# EAGLE schematic base (EAGLE 6.5.0)
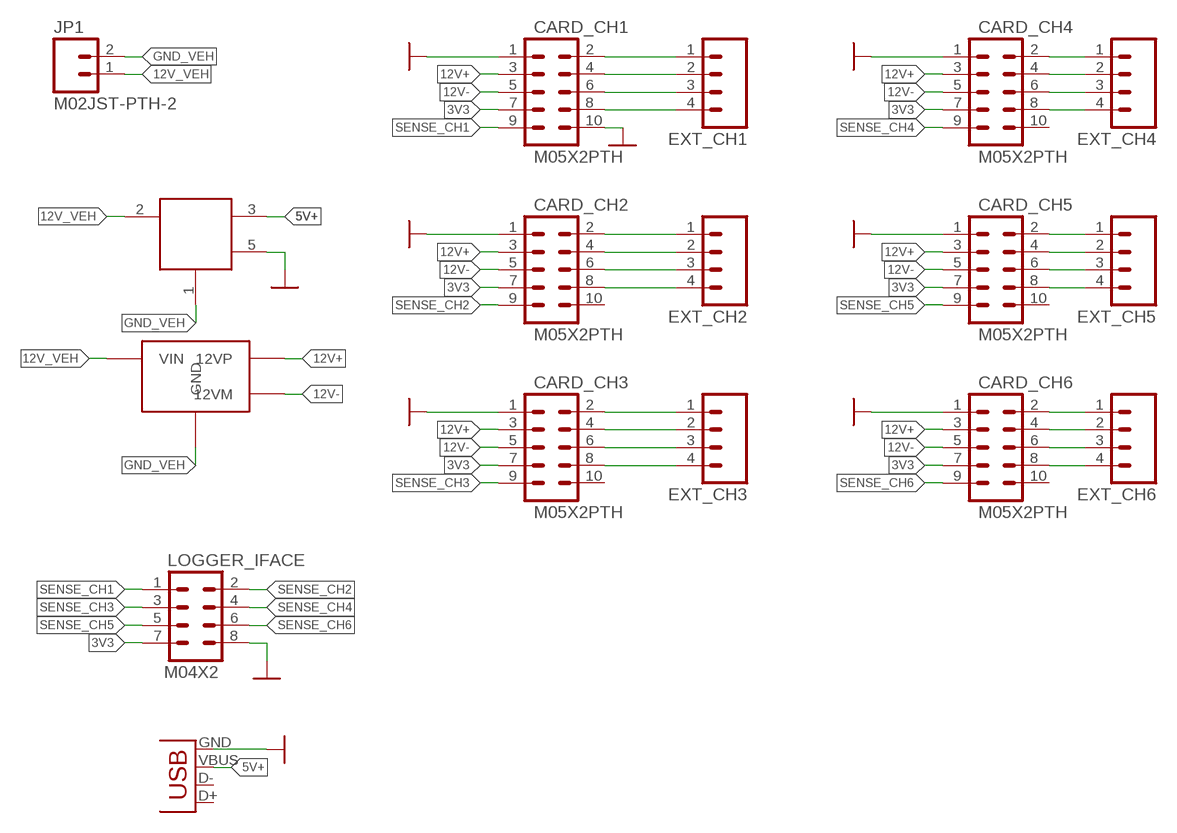
[diagram p0: schematic, sheet 1]

## Parts
CARD_CH1  M05X2PTH  [AVR_ICSP]
CARD_CH2  M05X2PTH  [AVR_ICSP]
CARD_CH3  M05X2PTH  [AVR_ICSP]
CARD_CH4  M05X2PTH  [AVR_ICSP]
CARD_CH5  M05X2PTH  [AVR_ICSP]
CARD_CH6  M05X2PTH  [AVR_ICSP]
EXT_CH1  M04PTH  [1X04]
EXT_CH2  M04PTH  [1X04]
EXT_CH3  M04PTH  [1X04]
EXT_CH4  M04PTH  [1X04]
EXT_CH5  M04PTH  [1X04]
EXT_CH6  M04PTH  [1X04]
JP1  M02JST-PTH-2  [JST-2-PTH]
JP2  USB-A-S  [USB-A-S]
LOGGER_IFACE  M04X2  [2X4]
U$1  NMXS1205UC_PTH  [NMXS1205UC_PTH]
U$2  TMR3122_12_CONV_PTH  [TMR3122_12_CONV_PTH]

## Nets
3V3: CARD_CH1.7 CARD_CH2.7 CARD_CH3.7 CARD_CH4.7 CARD_CH5.7 CARD_CH6.7 LOGGER_IFACE.7
5V+: JP2.VBUS U$1.3(5VOUT)
12V+: CARD_CH1.3 CARD_CH2.3 CARD_CH3.3 CARD_CH4.3 CARD_CH5.3 CARD_CH6.3 U$2.5(12VP)
12V-: CARD_CH1.5 CARD_CH2.5 CARD_CH3.5 CARD_CH4.5 CARD_CH5.5 CARD_CH6.5 U$2.6(12VM)
12V_VEH: JP1.1 U$1.2(VIN) U$2.2(VIN)
GND: CARD_CH1.1 CARD_CH1.10 CARD_CH2.1 CARD_CH3.1 CARD_CH4.1 CARD_CH5.1 CARD_CH6.1 JP2.GND LOGGER_IFACE.8 U$1.5(GNDOUT)
GND_VEH: JP1.2 U$1.1(GND) U$2.1(GND)
N$1: CARD_CH1.2 EXT_CH1.1
N$2: CARD_CH1.4 EXT_CH1.2
N$3: CARD_CH1.6 EXT_CH1.3
N$4: CARD_CH1.8 EXT_CH1.4
N$5: CARD_CH2.2 EXT_CH2.1
N$6: CARD_CH2.4 EXT_CH2.2
N$7: CARD_CH2.6 EXT_CH2.3
N$8: CARD_CH2.8 EXT_CH2.4
N$9: CARD_CH3.2 EXT_CH3.1
N$10: CARD_CH3.4 EXT_CH3.2
N$11: CARD_CH3.6 EXT_CH3.3
N$12: CARD_CH3.8 EXT_CH3.4
N$13: CARD_CH4.2 EXT_CH4.1
N$14: CARD_CH4.4 EXT_CH4.2
N$15: CARD_CH4.6 EXT_CH4.3
N$16: CARD_CH4.8 EXT_CH4.4
N$17: CARD_CH5.2 EXT_CH5.1
N$18: CARD_CH5.4 EXT_CH5.2
N$19: CARD_CH5.6 EXT_CH5.3
N$20: CARD_CH5.8 EXT_CH5.4
N$21: CARD_CH6.2 EXT_CH6.1
N$22: CARD_CH6.4 EXT_CH6.2
N$23: CARD_CH6.6 EXT_CH6.3
N$24: CARD_CH6.8 EXT_CH6.4
SENSE_CH1: CARD_CH1.9 LOGGER_IFACE.1
SENSE_CH2: CARD_CH2.9 LOGGER_IFACE.2
SENSE_CH3: CARD_CH3.9 LOGGER_IFACE.3
SENSE_CH4: CARD_CH4.9 LOGGER_IFACE.4
SENSE_CH5: CARD_CH5.9 LOGGER_IFACE.5
SENSE_CH6: CARD_CH6.9 LOGGER_IFACE.6
Unconnected: CARD_CH2.10 CARD_CH3.10 CARD_CH4.10 CARD_CH5.10 CARD_CH6.10 JP2.D+ JP2.D-

## Library data of the parts
CARD_CH1-CARD_CH6 = SparkFun-Connectors:M05X2: Header 5x2 Standard 10-pin dual row 0.1" header. Commonly used with AVR-ISP. Use with Spark Fun Electronics SKU: PRT-00778
EXT_CH1-EXT_CH6 = SparkFun-Connectors:M04: Header 4 Standard 4-pin 0.1" header. Use with straight break away headers (SKU : PRT-00116), right angle break away headers (PRT-00553), swiss pins (PRT-00743), machine pins (PRT-00117), and female headers (PRT-00115). Molex polarized connector foot print use with SKU : PRT-08231 with associated crimp pins and housings. 1MM SMD Version SKU: PRT-10208
JP1 = SparkFun-Connectors:M02: Standard 2-pin 0.1" header. Use with - straight break away headers ( PRT-00116) - right angle break away headers (PRT-00553) - swiss pins (PRT-00743) - machine pins (PRT-00117) - female headers (PRT-00115) Molex polarized connector foot print use with: PRT-08233 with associated crimp pins and housings. 2.54_SCREWTERM for use with PRT-10571. 3.5mm Screw Terminal footprints for PRT-08084 5mm Screw Terminal footprints for use with PRT-08433; SKU: PRT-09914
JP2 = SparkFun-Connectors:USB: USB Connectors USB-B-PTH is fully proven SKU : PRT-00139/CONN-08278 USB-miniB is fully proven SKU : PRT-00587 USB-A-PCB is untested. USB-A-H is throughly reviewed, but untested. Spark Fun Electronics SKU : PRT-00437 USB-B-SMT is throughly reviewed, but untested. Needs silkscreen touching up. USB-A-S has not been used/tested USB-MB-H has not been used/tested USB-MICROB has been used. CONN-09505
LOGGER_IFACE = SparkFun-Connectors:M04X2: .1" header, two rows of four.
U$1 = evlogger:NMXS1205UC_PTH
U$2 = evlogger:TMR3122_12_CONV_PTH